# EAGLE design Arduino Shield (EAGLE 9.6.2)
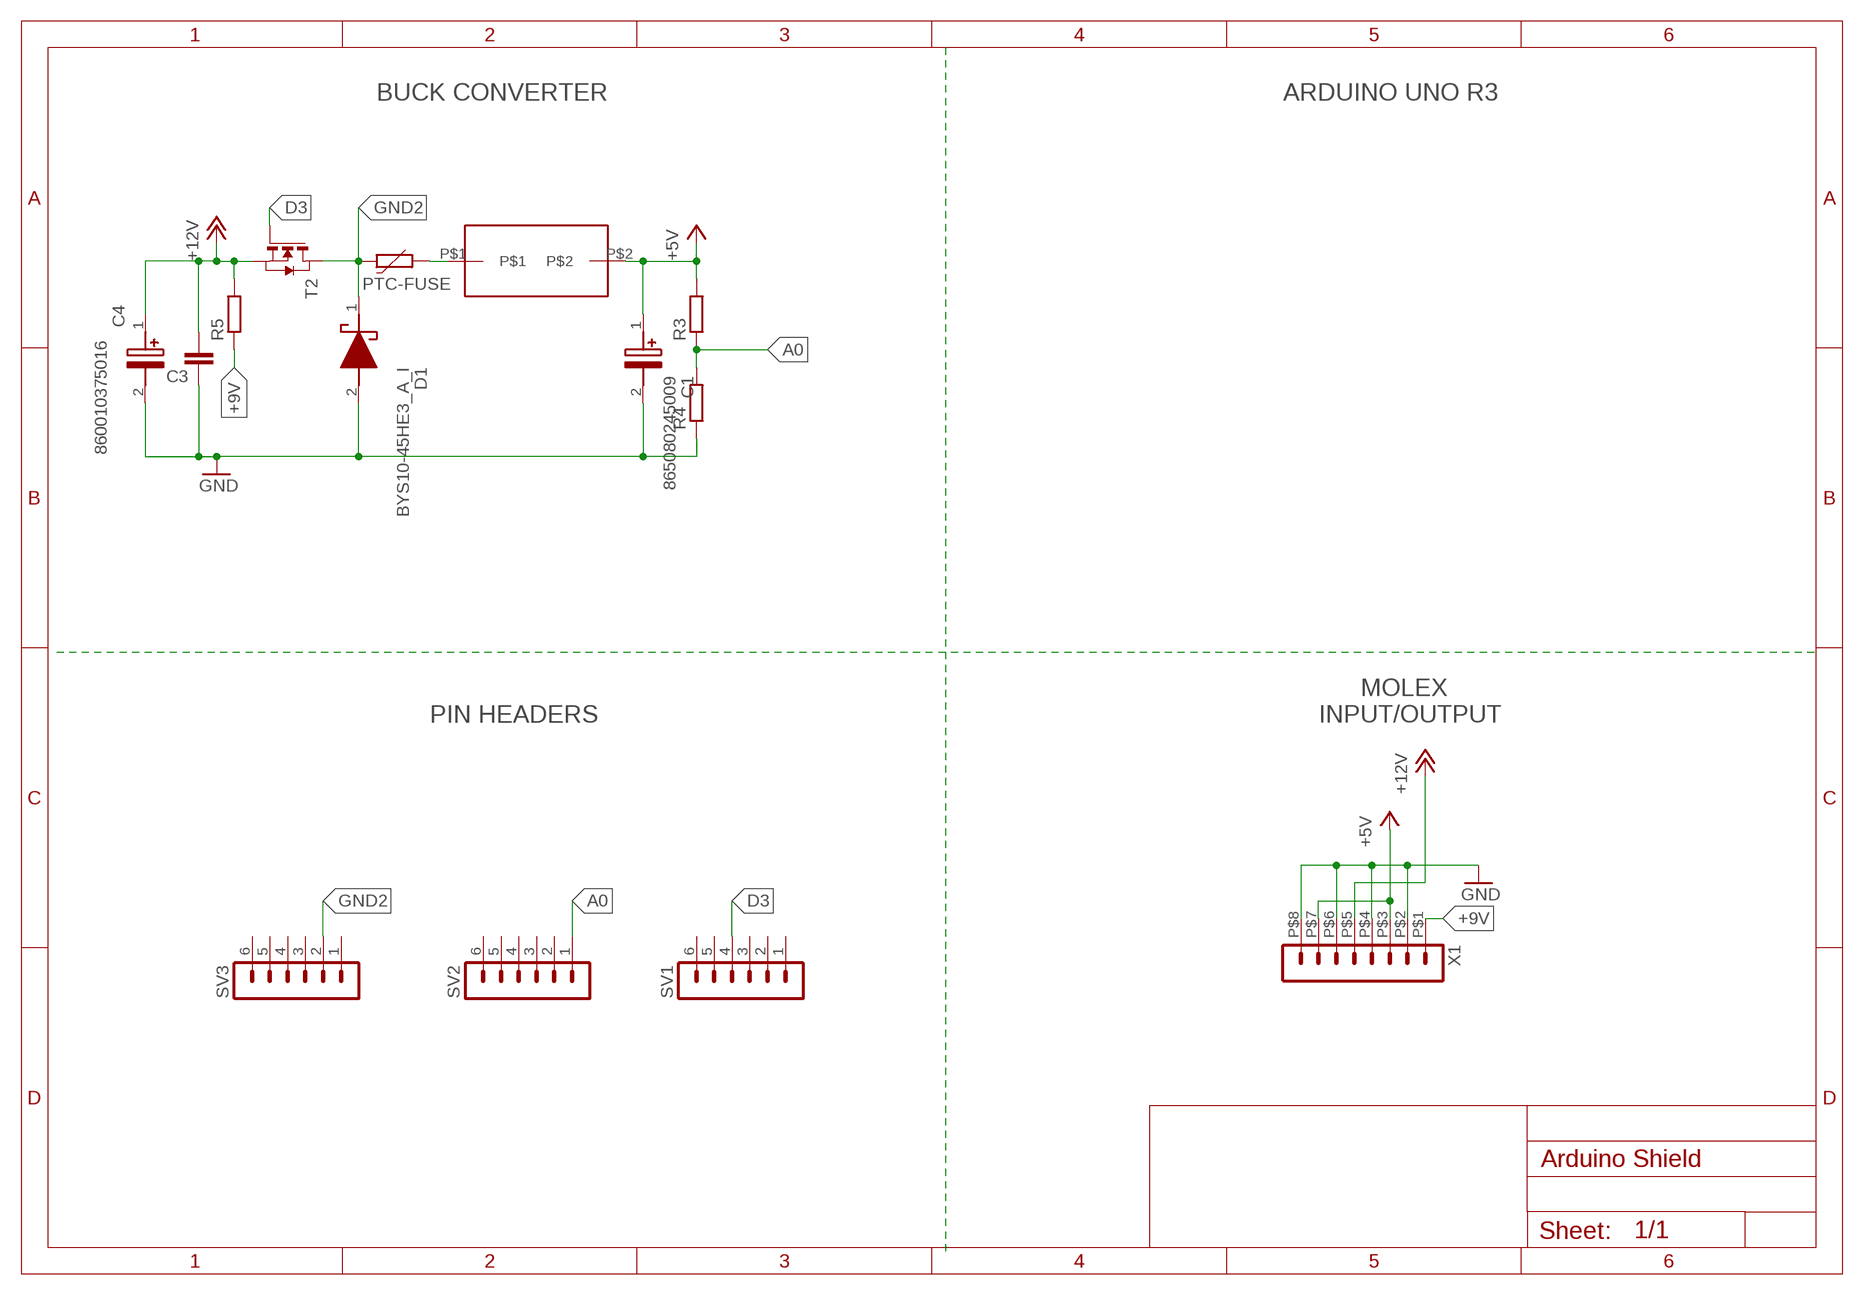
[diagram p0: schematic, sheet 1]

## Parts
C1  865080245009  [CAPAE660X770N]
C3  C-EUC1206K  [C1206K]
C4  860010375016  [CAPPRD500W62D1000H1750]
D1  BYS10-45HE3_A_I  [DIOM5127X229N]
FUSE  PTC-FUSE  [1206]
R3  R-EU_R1206  [R1206]
R4  R-EU_R1206  [R1206]
R5  R-EU_R1206  [R1206]
SV1  MA06-1_PINHEADERS  [MA06-1]
SV2  MA06-1_PINHEADERS  [MA06-1]
SV3  MA06-1_PINHEADERS  [MA06-1]
T2  NMOSSOT23  [SOT-23]
U$2  DR1050-INDUCTOR  [DR1050-INDUCTOR]
X1  HEADER_POS8_43045-0812  [43045-0812]

## Nets
+5V: C1.1(+) R3.2 U$2.P$2 X1.P$3 X1.P$7
+9V: R5.1 X1.P$1
+12V: C3.2 C4.1(+) R5.2 T2.2(S) X1.P$5
A0: R3.1 R4.2 SV2.1
D3: SV1.4 T2.3(G)
GND: C1.2(-) C3.1 C4.2(-) D1.2(A) R4.1 X1.P$2 X1.P$4 X1.P$6 X1.P$8
GND2: D1.1(K) FUSE.1 SV3.2 T2.1(D)
N$2: FUSE.2 U$2.P$1
Unconnected: SV1.1 SV1.2 SV1.3 SV1.5 SV1.6 SV2.2 SV2.3 SV2.4 SV2.5 SV2.6 SV3.1 SV3.3 SV3.4 SV3.5 SV3.6

## Notes on the sheet
- BUCK CONVERTER | ARDUINO UNO R3
- PIN HEADERS
- MOLEX
  INPUT/OUTPUT

## Library data of the parts
C1 = 865080245009:865080245009: Wurth Elektronik 220uF 10 V dc Aluminium Electrolytic Capacitor, WCAP-ASLI Series 2000h 6.3 (Dia.) x 7.55mm Source: Datasheet <https://www.we-online.com/components/products/datasheet/865080245009.pdf>; DESCRIPTION: Wurth Elektronik 220uF 10 V dc Aluminium Electrolytic Capacitor, WCAP-ASLI Series 2000h 6.3 (Dia.) x 7.55mm; HEIGHT: 7.7mm; MANUFACTURER_NAME: Wurth Elektronik; MANUFACTURER_PART_NUMBER: 865080245009; MOUSER_PART_NUMBER: 710-865080245009; MOUSER_PRICE-STOCK: https://www.mouser.co.uk/ProductDetail/Wurth-Elektronik/865080245009?qs=0KOYDY2FL29txZ55US1VdQ%3D%3D
C3 = IIT_BOMBAY_Racing:C-EU: CAPACITOR, European symbol
C4 = 860010375016:860010375016: Wurth Elektronik 820uF 16 V dc Aluminium Electrolytic Capacitor, WCAP-ATG8 Series 2000h 10 (Dia.) x 16mm Source: Datasheet <https://www.mouser.in/datasheet/2/445/860010375016-1725173.pdf>; DESCRIPTION: Wurth Elektronik 820uF 16 V dc Aluminium Electrolytic Capacitor, WCAP-ATG8 Series 2000h 10 (Dia.) x 16mm; HEIGHT: 17.5mm; MANUFACTURER_NAME: Wurth Elektronik; MANUFACTURER_PART_NUMBER: 860010375016; MOUSER_PART_NUMBER: 710-860010375016; MOUSER_PRICE-STOCK: https://www.mouser.co.uk/ProductDetail/Wurth-Elektronik/860010375016?qs=0KOYDY2FL2%252BmdJSZ2GfWHQ%3D%3D
D1 = BYS10-45HE3_A_I:BYS10-45HE3_A_I: Schottky Diodes & Rectifiers 45V Sctky Bar Rectfr SMA (DO-214AC) Source: Datasheet <https://www.arrow.com/en/products/bys10-45he3-ai/vishay?region=nac>; DESCRIPTION: Schottky Diodes & Rectifiers 45V Sctky Bar Rectfr SMA (DO-214AC); HEIGHT: 2.29mm; MANUFACTURER_NAME: Vishay; MANUFACTURER_PART_NUMBER: BYS10-45HE3_A/I; MOUSER_PART_NUMBER: 78-BYS10-45HE3_A/I; MOUSER_PRICE-STOCK: https://www.mouser.co.uk/ProductDetail/Vishay-General-Semiconductor/BYS10-45HE3_A-I?qs=MLItCLRbWswaWViKH%2FRD3Q%3D%3D; OC_FARNELL: unknown
FUSE = IIT_BOMBAY_Racing:PTC-FUSE; OC_FARNELL: unknown
R3-R5 = IIT_BOMBAY_Racing:R-EU_: RESISTOR, European symbol
SV1-SV3 = IIT_BOMBAY_Racing:MA06-1_PINHEADERS: PIN HEADER; OC_FARNELL: unknown; OC_NEWARK: unknown
T2 = IIT_BOMBAY_Racing2:NMOSSOT23: MOS FET; OC_FARNELL: unknown; OC_NEWARK: unknown
U$2 = DR1050-INDUCTOR:DR1050-INDUCTOR
X1 = IIT_BOMBAY_Racing2:HEADER_POS8_?: Molex - Micro-Fit 3.0 Series connector, 3.00mm (0.118") pitch header, 8 positions.; OC_FARNELL: unknown

## Board
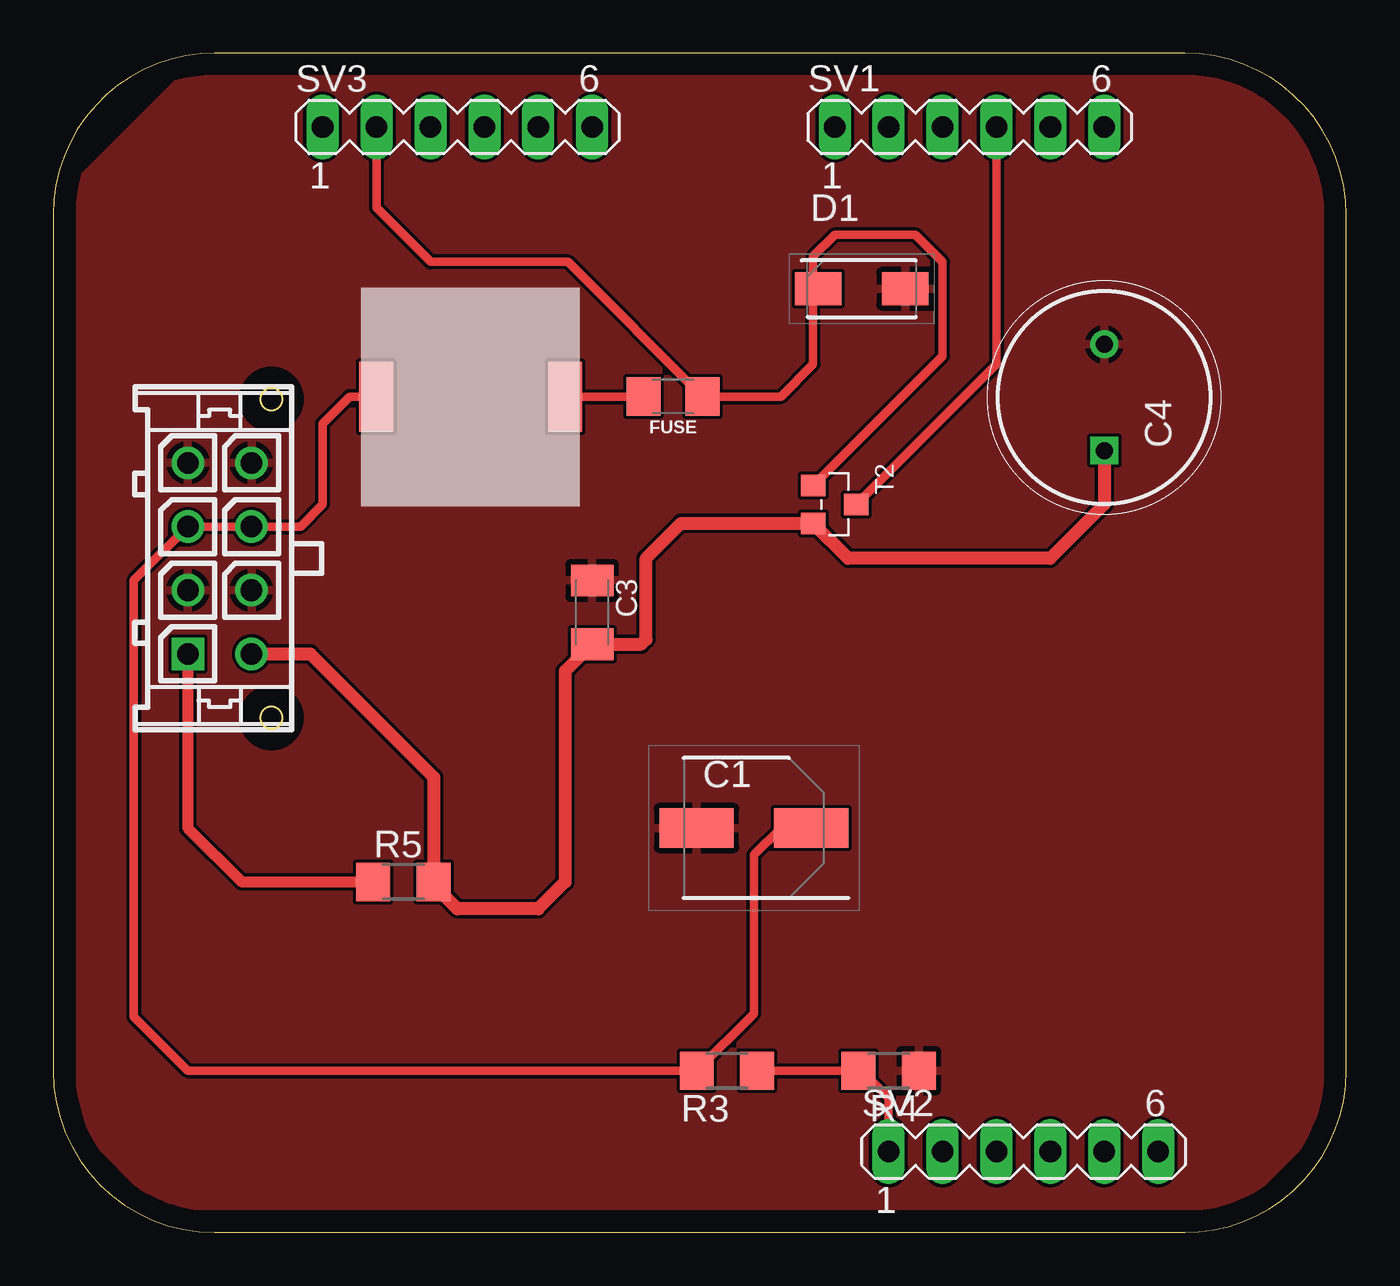
[diagram p1: board, top side]
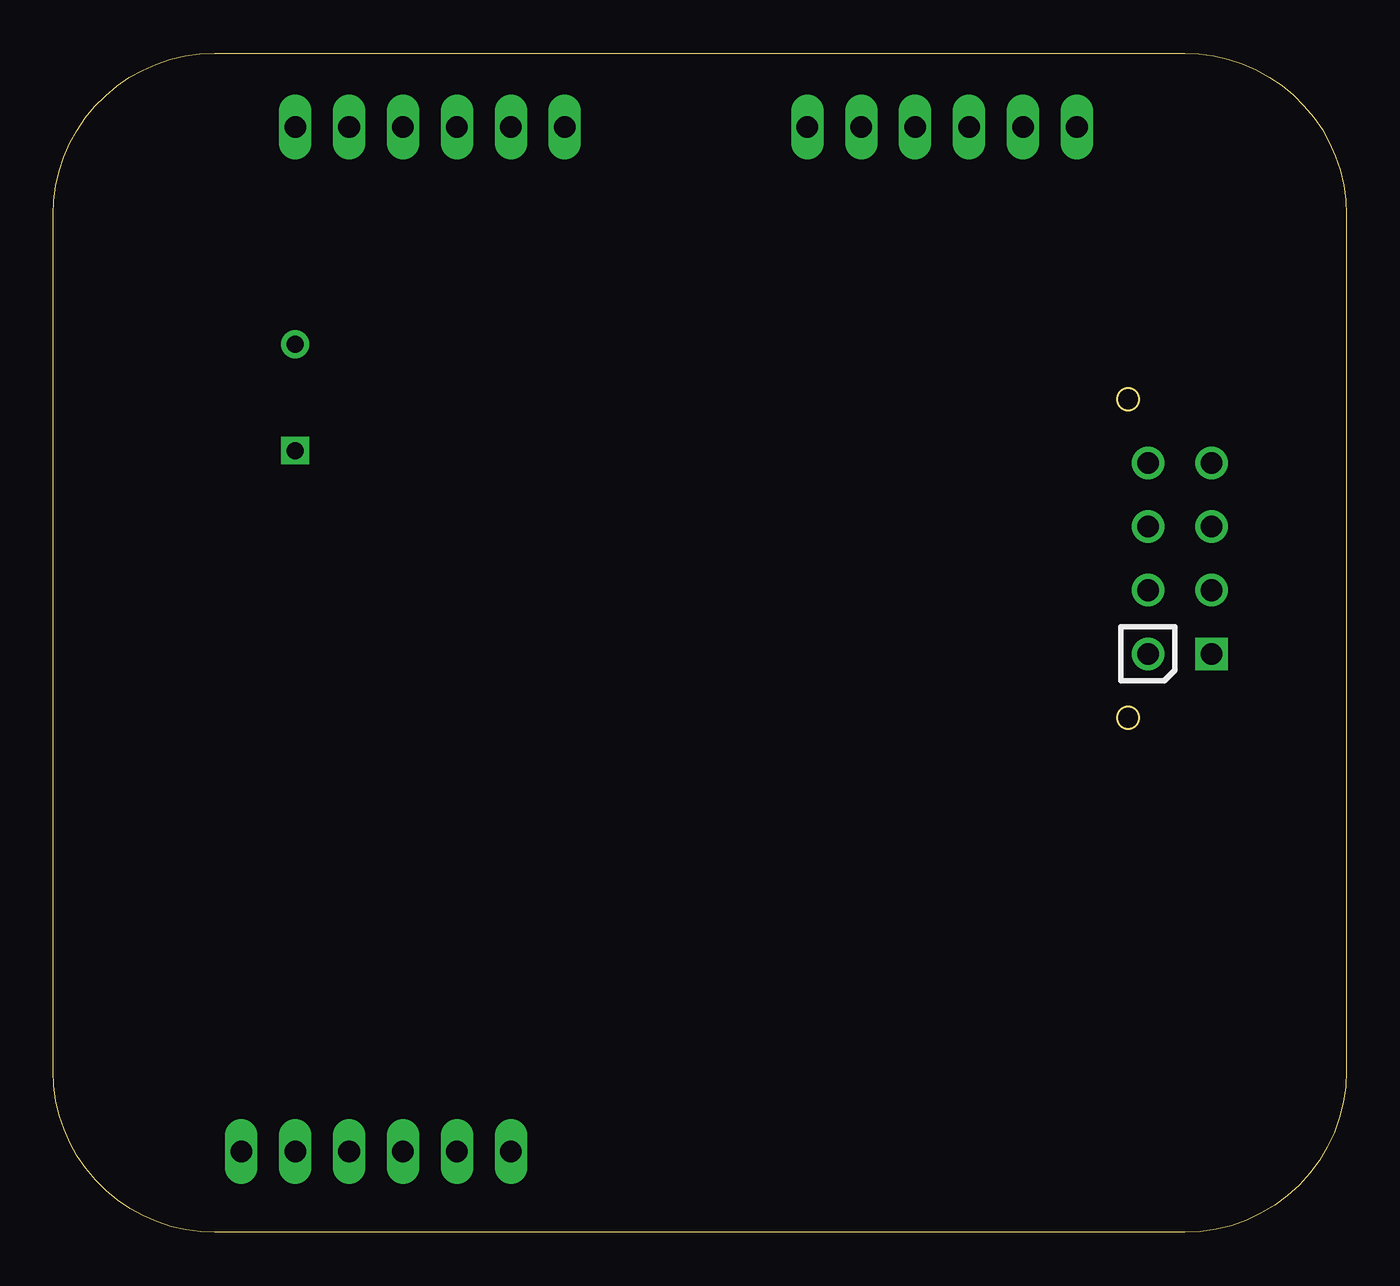
[diagram p2: board, bottom side, seen from below]

Size 60.94 x 55.55 mm. Coordinates in mm from the lower left corner, seen from the top.
Outline: 0,47.93 0,7.62 arc90 7.62,0 53.32,0 53.98,0.03 arc85 60.94,7.62 60.94,47.93 60.91,48.59 arc85 53.32,55.55 7.62,55.55 6.96,55.52 arc85 0,47.93
Outline: circle at 10.29,24.25 radius 0.51
Outline: circle at 10.29,39.25 radius 0.51
Copper layers (1*16): Top 0.035mm / dielectric 1.5mm / Bottom 0.035mm
Design rules "default": minimum track width 6mil, minimum drill 0.35mm, track to track 6mil, track to pad 6mil, pad to pad 6mil, via to via 6mil, smd to smd 6mil, copper to edge 40mil, drill to drill 6mil, minimum pad ring 10mil, minimum via ring 8mil, stop-mask expansion 4mil, vias tented up to drill 0mil, thermal gap 10mil
Holes 1.02 mm at 10.29,24.25 10.29,39.25 10.29,24.25 10.29,39.25

### Footprints (pad centres in the part's own frame; a part is rotated, then mirrored left to right if it is on the bottom)
CAPAE660X770N = smd 3.5 x 1.85: 1 -2.7,0; 2 2.7,0
C1206K = smd 1.5 x 2: 1 -1.5,0; 2 1.5,0
CAPPRD500W62D1000H1750 = drill 0.8 pad 1.2 square: 1 0,0 | drill 0.8 pad 1.2: 2 5,0
DIOM5127X229N = smd 2.2 x 1.55: 1 -2.05,0; 2 2.05,0
1206 = smd 1.6 x 1.8: 1 -1.4,0; 2 1.4,0
R1206 = smd 1.6 x 1.803: 1 -1.422,0; 2 1.422,0
MA06-1 = drill 1.016 long: 1 -6.35,0; 2 -3.81,0; 3 -1.27,0; 4 1.27,0; 5 3.81,0; 6 6.35,0
SOT-23 = smd 1.016 x 1.143: 1 -0.889,-1.016; 2 0.889,-1.016; 3 0,1.016
DR1050-INDUCTOR = smd 3.3 x 1.6: P$1 0,0; P$2 0,8.9
43045-0812 = drill 1.02 square: P$1 4.5,0 | drill 1.02: P$2 1.5,0; P$3 -1.5,0; P$4 -4.5,0; P$5 4.5,3; P$6 1.5,3; P$7 -1.5,3; P$8 -4.5,3 | hole 1.02: 7.5,3.94; -7.5,3.94

### Placement (x,y rotation side)
C1  33.02,19.05 180 top
C3  25.4,29.21 270 top
C4  49.53,36.83 90 top
D1  38.1,44.45 0 top
FUSE  29.21,39.37 180 top
R3  31.75,7.62 180 top
R4  39.37,7.62 180 top
R5  16.51,16.51 0 top
SV1  43.18,52.07 0 top
SV2  45.72,3.81 0 top
SV3  19.05,52.07 0 top
T2  36.83,34.29 270 top
U$2  24.13,39.37 90 top
X1  6.35,31.75 270 top

### Tracks (layer width: path | path; a pad name or v marks a point on that pad's centre or on a via)
+5V
  Top 0.406: C1.1 34.29,19.05 33.02,17.78 33.02,10.31 R3.2 6.35,7.62 3.81,10.16 3.81,30.71 X1.P$3 X1.P$7 11.66,33.25 12.7,34.29 12.7,38.1 13.97,39.37 U$2.P$2
+9V
  Top 0.508: X1.P$1 6.35,19.05 8.89,16.51 R5.1
+12V
  Top 0.61: X1.P$5 12.12,27.25 17.93,21.44 R5.2 17.93,16.36 19.05,15.24 22.86,15.24 24.13,16.51 24.13,26.44 C3.2 27.71,27.71 27.94,27.94 27.94,31.75 29.59,33.4 T2.2 37.46,31.75 46.99,31.75 49.53,34.29 C4.1
A0
  Top 0.406: R3.1 R4.2 38.1,7.62 39.37,6.35 SV2.1
D3
  Top 0.406: SV1.4 44.45,40.89 T2.3
GND
  pour Top: 6.35,54.61 1.27,49.53 1.27,5.08 5.08,1.27 55.88,1.27 59.69,5.08 59.69,50.8 55.88,54.61
GND2
  Top 0.406: 35.81,44.21 D1.1 | 35.81,44.21 35.81,40.89 34.29,39.37 FUSE.1 24.26,45.72 17.78,45.72 15.24,48.26 SV3.2 | T2.1 41.91,41.28 41.91,45.72 40.64,46.99 36.83,46.99 35.81,45.97 35.81,44.21
N$2
  Top 0.406: U$2.P$1 FUSE.2